# Altium schematic sheet RESET.SchDoc
size A4
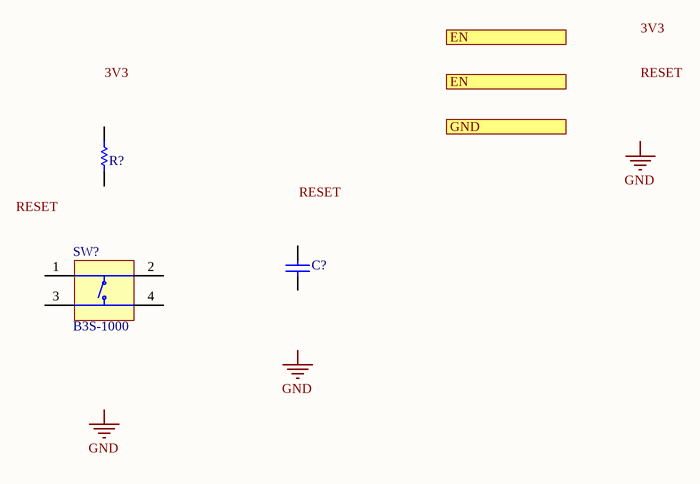
[diagram p0: RESET.SchDoc]

## Parts
C?  C1206C105K5RACTU  [CAPC3216X110X50LL20T25]  (value not drawn)
R?  RK73B2ATTD103J  [RESC2013X60X30ML20T20]  (value not drawn)
SW?  B3S-1000  [OMRON-B3S-1000-4_V]

## Ports
EN, GND

## Nets

Not connected (* = marked no-connect by the designer): C? 1 2; R? 1 2; SW? 1 2 3 4

## Notes on the sheet
- Labels drawn without touching a wire or pin: 3V3, GND, RESET

## Library data of the parts
C? = CMP-2000-06011-1: Chip Capacitor, 1 uF, +/- 10%, 50 V, -55 to 125 degC, 1206 (3216 Metric), RoHS, Tape and Reel; Manufacturer: Kemet; Case Height: 1mm; Dielectric: X7R; Voltage Rating: 50V; Capacitance: 1uF; Temperature Coefficient / Code: +/-15%; Case Length: 3.2mm; Case Width: 1.6mm; Type: SMDMLCCX7R6.3-250VDCCommericalGrade; Class: Class1; Capacitance - nF: 1000nF; Datasheet URL: http://www.kemet.com/docfinder?Partnumber=C1206C105K5RACTU; Product Category: MultilayerCeramicCapacitorsMLCC-SMD/SMT; Termination Style: SMD/SMT; Dimensions: 1.6mmWx3.2mmLx1mmH; Voltage Rating DC: 50V; Datasheet Version: 02/2016; Packaging: Reel; Brand: Kemet; RoHS: Details; Minimum Operating Temperature: -55C; Operating Temperature Range: -55Cto+125C; Package Reference: 1206; Manufacturer URL: http://www.kemet.com/; Product: GeneralTypeMLCCs; Tolerance: 10%; Package Description: 2-Pin Surface Mount Device, Body 3.2 x 1.6 mm; Mounting Technology: SurfaceMount; Case Code - mm: 3216; Maximum Operating Temperature: +125C; Series: C1206C; Factory Pack Quantity: 2500; Package / Case: 1206(3216metric); Case Code - in: 1206
R? = CMP-2001-04657-1: 10 kOhms ±5% 0.25W, 1/4W Chip Resistor 0805 (2012 Metric) Automotive AEC-Q200, Moisture Resistant Thick Film; Manufacturer: KOA Speer; Part Number: RK73B2ATTD103J
SW? = CMP-1677-00001-4: Sealed Tactile Switch, SPST-NO, 3 to 24 V, -25 to 70 degC, 4-Pin SMD, RoHS, Bulk; Manufacturer: Omron; Voltage Rating: 24 V; Current Rating: 50 mA; Contact Plating: Silver; ComponentLink1Description: Manufacturer URL; Packaging: Bulk; Package Quantity: 1500; Min Operating Temperature: -25 degC; Max Operating Temperature: 70 degC; REACH SVHC: No SVHC; ComponentLink1URL: http://www.omron.com/; RoHSCompliant: true; PackageDescription: 4-Pin Surface Mount Device, Body 6.6 x 6 mm; ComponentLink2URL: http://www.omron.com/ecb/products/pdf/en-b3s.pdf; DatasheetVersion: 10/2014; Length: 6.6 mm; Height: 4.3 mm; ComponentLink2Description: Datasheet; Mount: Surface Mount; Mounting Technology: Surface Mount; PackageReference: B3S-1000